# Altium project bbr18_motor_battery_connection_board.PrjPCB
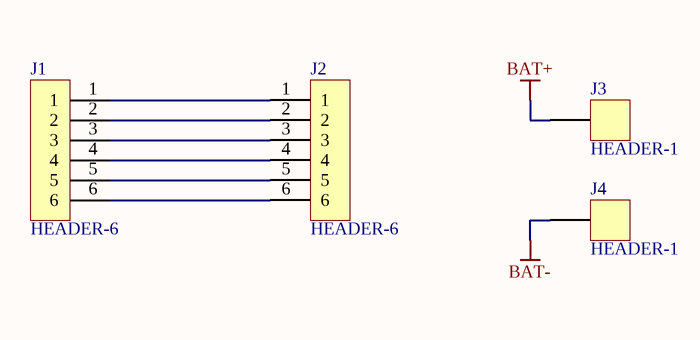
[diagram p0: bbr18_motor_battery_connection_board.SchDoc]
1 sheet, 4 parts. Net scope: global (net labels, ports and power ports of the same name join across sheets).
Board file: bbr18_motor_battery_connection_board.PcbDoc

## Sheet bbr18_motor_battery_connection_board.SchDoc
size A4

### Parts
J1  HEADER-6  [MICRO-MATCH-FOB-06]
J2  HEADER-6  [MICRO-MATCH-FOB-06]
J3  HEADER-1  [2MM-BANANA-VIA]
J4  HEADER-1  [2MM-BANANA-VIA]

### Nets
BAT+: J3.1
BAT-: J4.1
NetJ1_1: J1.1 J2.1
NetJ1_2: J1.2 J2.2
NetJ1_3: J1.3 J2.3
NetJ1_4: J1.4 J2.4
NetJ1_5: J1.5 J2.5
NetJ1_6: J1.6 J2.6